# Altium schematic sheet N303-3V1.0.schdoc
size A4
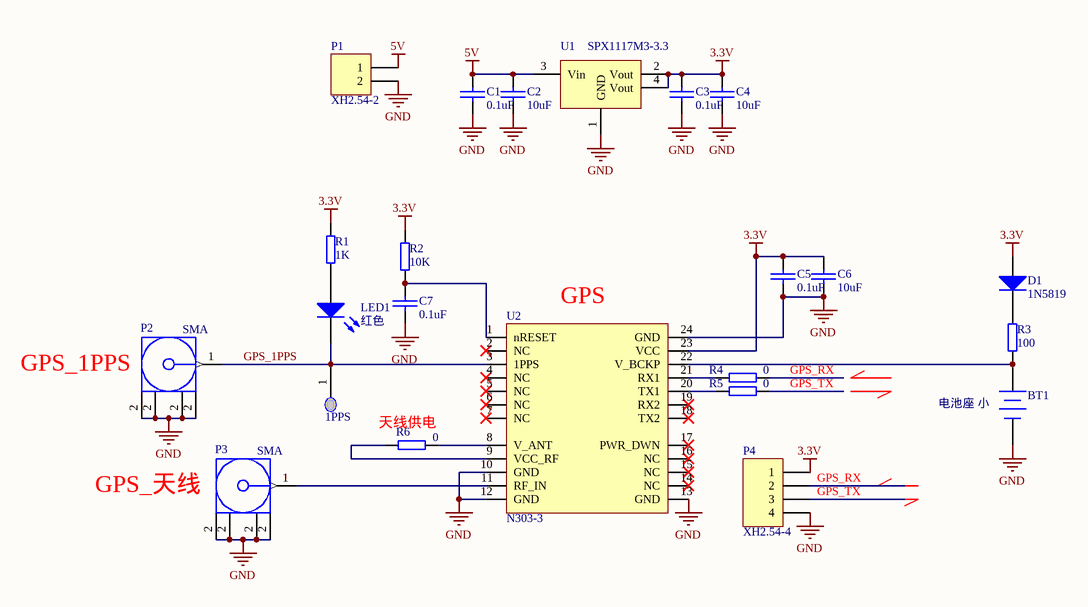
[diagram p0: N303-3V1.0.schdoc]

## Parts
1PPS  TEST  [测试点（圆形）]  (value not drawn)
BT1  电池座 小  [电池座 2032 贴片 BS-8]
C1  0.1uF  [0805]
C2  10uF  [1206]
C3  0.1uF  [0805]
C4  10uF  [1206]
C5  0.1uF  [0805]
C6  10uF  [1206]
C7  0.1uF  [0805]
D1  1N5819  [二极管 贴片 IN4148]
LED1  红色  [LED5_单色]
P1  XH2.54-2  [VH2.54_2]
P2  SMA  [天线座 50ohm 直立]
P3  SMA  [天线座 50ohm 直立]
P4  XH2.54-4  [VH2.54_4]
R1  1K  [0805]
R2  10K  [0805]
R3  100  [0805]
R4  0  [0805]
R5  0  [0805]
R6  0  [0805]
U1  SPX1117M3-3.3  [SOT223]
U2  N303-3  [模块 N303-3]

## Nets
3.3V: C3.2 C4.2 C5.2 C6.2 D1.1(A) P4.1 R1.1 R2.1 U1.2(Vout) U1.4(Vout) U2.23(VCC)
5V: C1.2 C2.2 P1.1 U1.3(Vin)
GND: BT1.2(-) C1.1 C2.1 C3.1 C4.1 C5.1 C6.1 C7.1 P1.2 P2.2 P3.2 P4.4 U1.1(GND) U2.10(GND) U2.12(GND) U2.13(GND) U2.24(GND)
GPS_1PPS: 1PPS.1 LED1.2(K) P2.1(Signal) U2.3(1PPS)
GPS_RX: P4.2 R4.1
GPS_TX: P4.3 R5.1
NetBT1_1: BT1.1(+) R3.2 U2.22(V_BCKP)
NetC7_2: C7.2 R2.2 U2.1(nRESET)
NetD1_2: D1.2(K) R3.1
NetLED1_1: LED1.1(A) R1.2
NetP3_1: P3.1(Signal) U2.11(RF_IN)
NetR4_2: R4.2 U2.21(RX1)
NetR5_2: R5.2 U2.20(TX1)
NetR6_1: R6.1 U2.8(V_ANT)
NetR6_2: R6.2 U2.9(VCC_RF)

Not connected (* = marked no-connect by the designer): U2 2(NC)* 4(NC)* 5(NC)* 6(NC)* 7(NC)* 14(NC)* 15(NC)* 16(NC)* 17(PWR_DWN)* 18(TX2)* 19(RX2)*

## Notes on the sheet
- (near U2) GPS
- (near P2) GPS_1PPS
- (near R6) 天线供电
- (near P3) GPS_天线

## Library data of the parts
1PPS = 测试点_小: 单位: 个; 名称: 测试点; 封装: 直插
C1 C3 C5 C7 = 电容 贴片 0805: 名称: 贴片电容; 单位: 个; 封装: 0805
C2 C4 C6 = 电容 贴片 0805: 名称: 贴片电容; 封装: 0805; 单位: 个
D1 = 二极管 贴片 1N4148: 名称: 贴片二极管; 封装: 贴片; 单位: 个
LED1 = 贴片发光二极管 0805: 封装: 0805; 单位: 个; 名称: 贴片发光二极管
P1 = 连接件 XH2.54-2: 名称: 连接件; 封装: VH3.96-2; 单位: 套
P2 P3 = 联结件 天线座 SMA: 单位: 个; 封装: 直插; 名称: 联接件
P4 = 联结件 XH2.54-4: 名称: 联结件; 单位: 套; 封装: XH2.54-4
R1-R6 = 电阻 贴片 0805: 名称: 贴片电阻; 单位: 个; 封装: 0805
U1 = 贴片芯片 SPX1117M3-3.3: LDO; 名称: 贴片芯片; 单位: 个; 封装: SOT223
U2 = 模块 N303-3: 单位: 个; 名称: 模块; 封装: 贴片
BT1 = 电池座 小: Published: 24-Mar-1999; LatestRevisionDate: 17-Jul-2002; LatestRevisionNote: Re-released for DXP Platform.; PackageReference: BAT-2; Publisher: Altium Limited